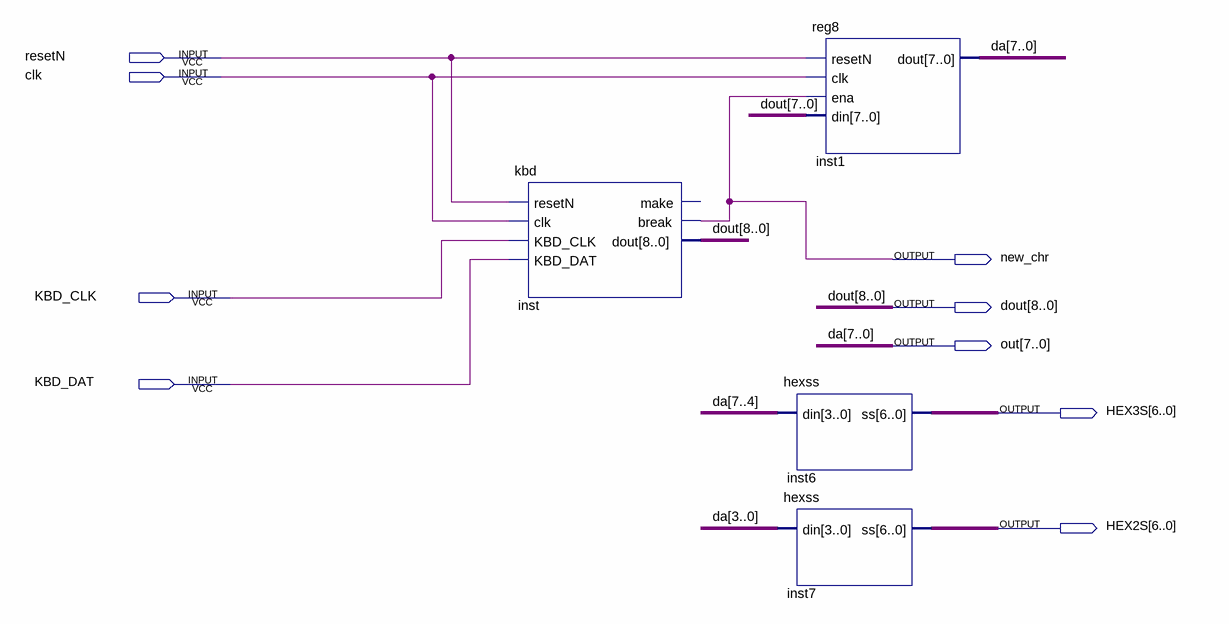
[diagram p0: schematic sheet]
// Quartus schematic kbd_pack.bdf as structural Verilog: 4 symbols, 9 pins
module kbd_pack (
  input  resetN,
  input  clk,
  input  KBD_CLK,
  input  KBD_DAT,
  output new_chr,
  output [8:0] dout,
  output [7:0] out,
  output [6:0] HEX3S,
  output [6:0] HEX2S
);

  kbd inst (
    .resetN(resetN), .clk(clk), .KBD_CLK(KBD_CLK), .KBD_DAT(KBD_DAT), .\break (new_chr), .dout(dout));  // open: make
  hexss inst6 (.din(out[7:4]), .ss(HEX3S));
  hexss inst7 (.din(out[3:0]), .ss(HEX2S));
  reg8 inst1 (.resetN(resetN), .clk(clk), .ena(new_chr), .din(dout[7:0]), .dout(out));

  // Other names for the same wires on the sheet: da[7:0] = out
endmodule
